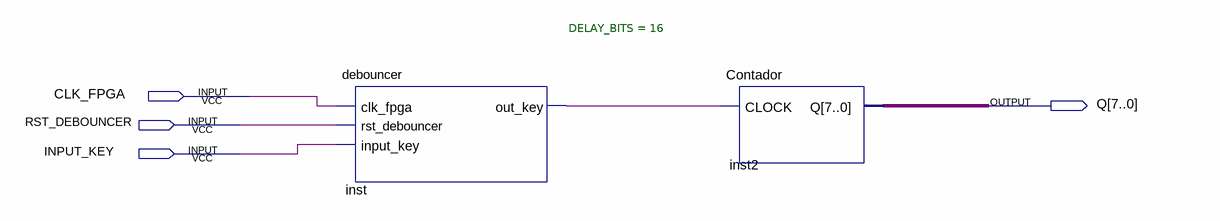
[diagram p0: schematic sheet]
// Quartus schematic rascunho.bdf as structural Verilog: 2 symbols, 4 pins
module rascunho (
  input  CLK_FPGA,
  input  RST_DEBOUNCER,
  input  INPUT_KEY,
  output [7:0] Q
);

  wire inst_out_key;

  debouncer #(.DELAY_BITS(16)) inst (
    .clk_fpga(CLK_FPGA), .rst_debouncer(RST_DEBOUNCER), .input_key(INPUT_KEY), .out_key(inst_out_key));
  Contador inst2 (.CLOCK(inst_out_key), .Q(Q));
endmodule
